# Altium schematic sheet NVME.SchDoc
size C; SheetNumber: 5; SheetTotal: 11
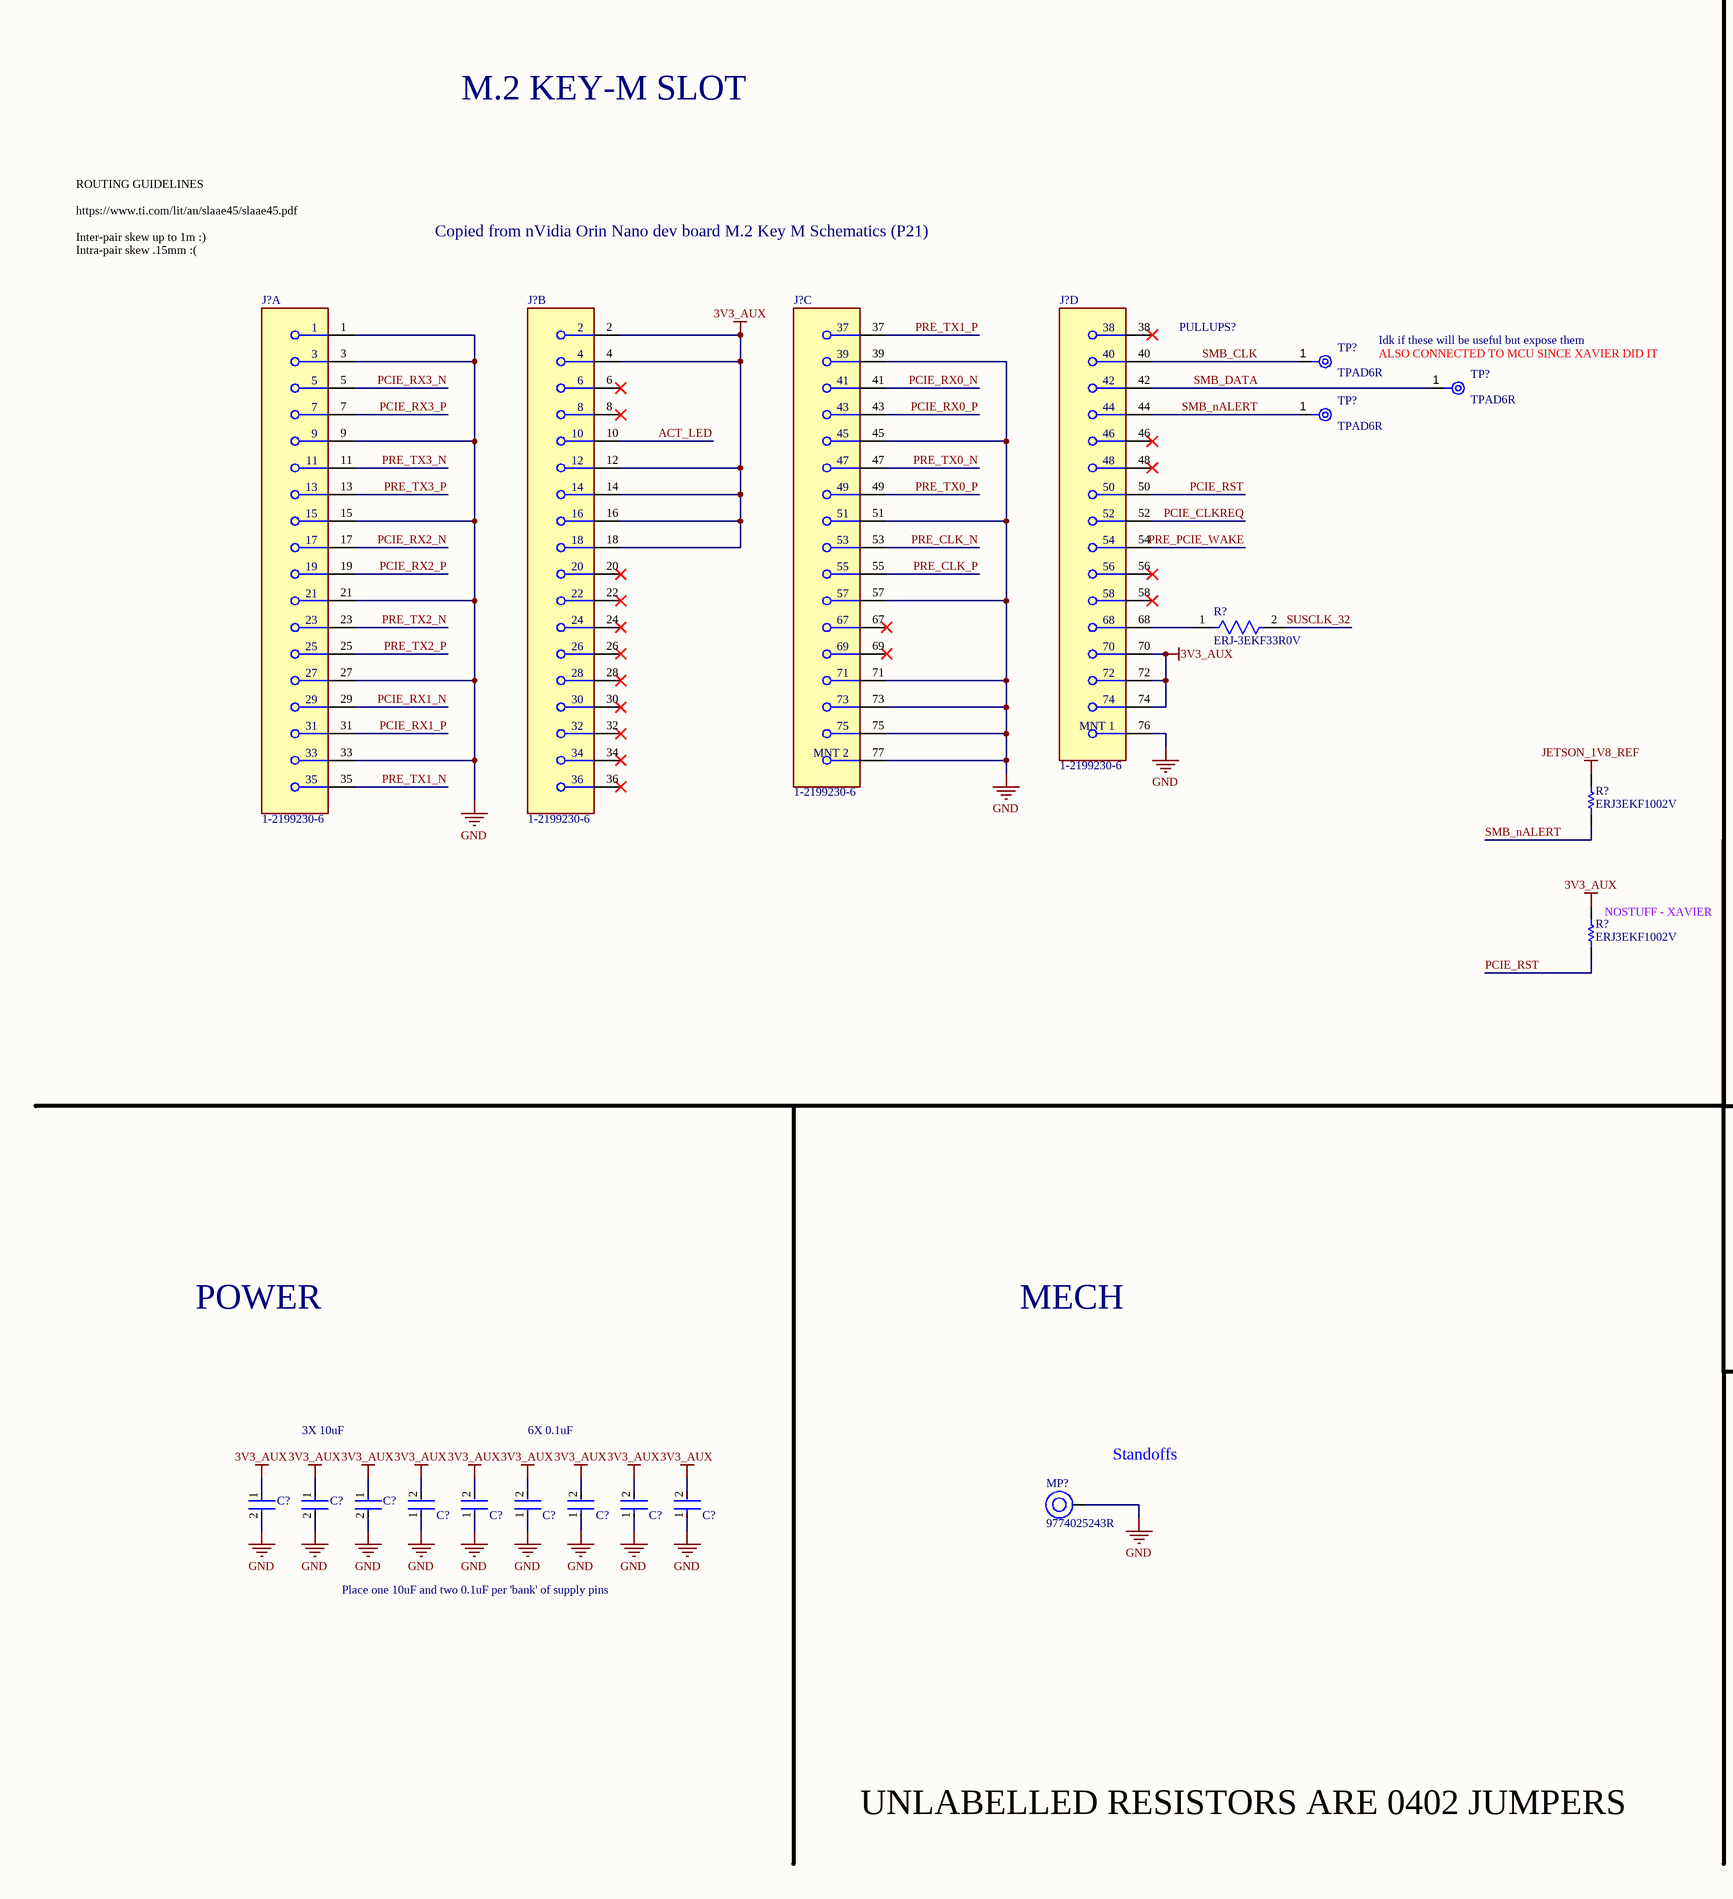
[diagram p0: NVME.SchDoc, left]
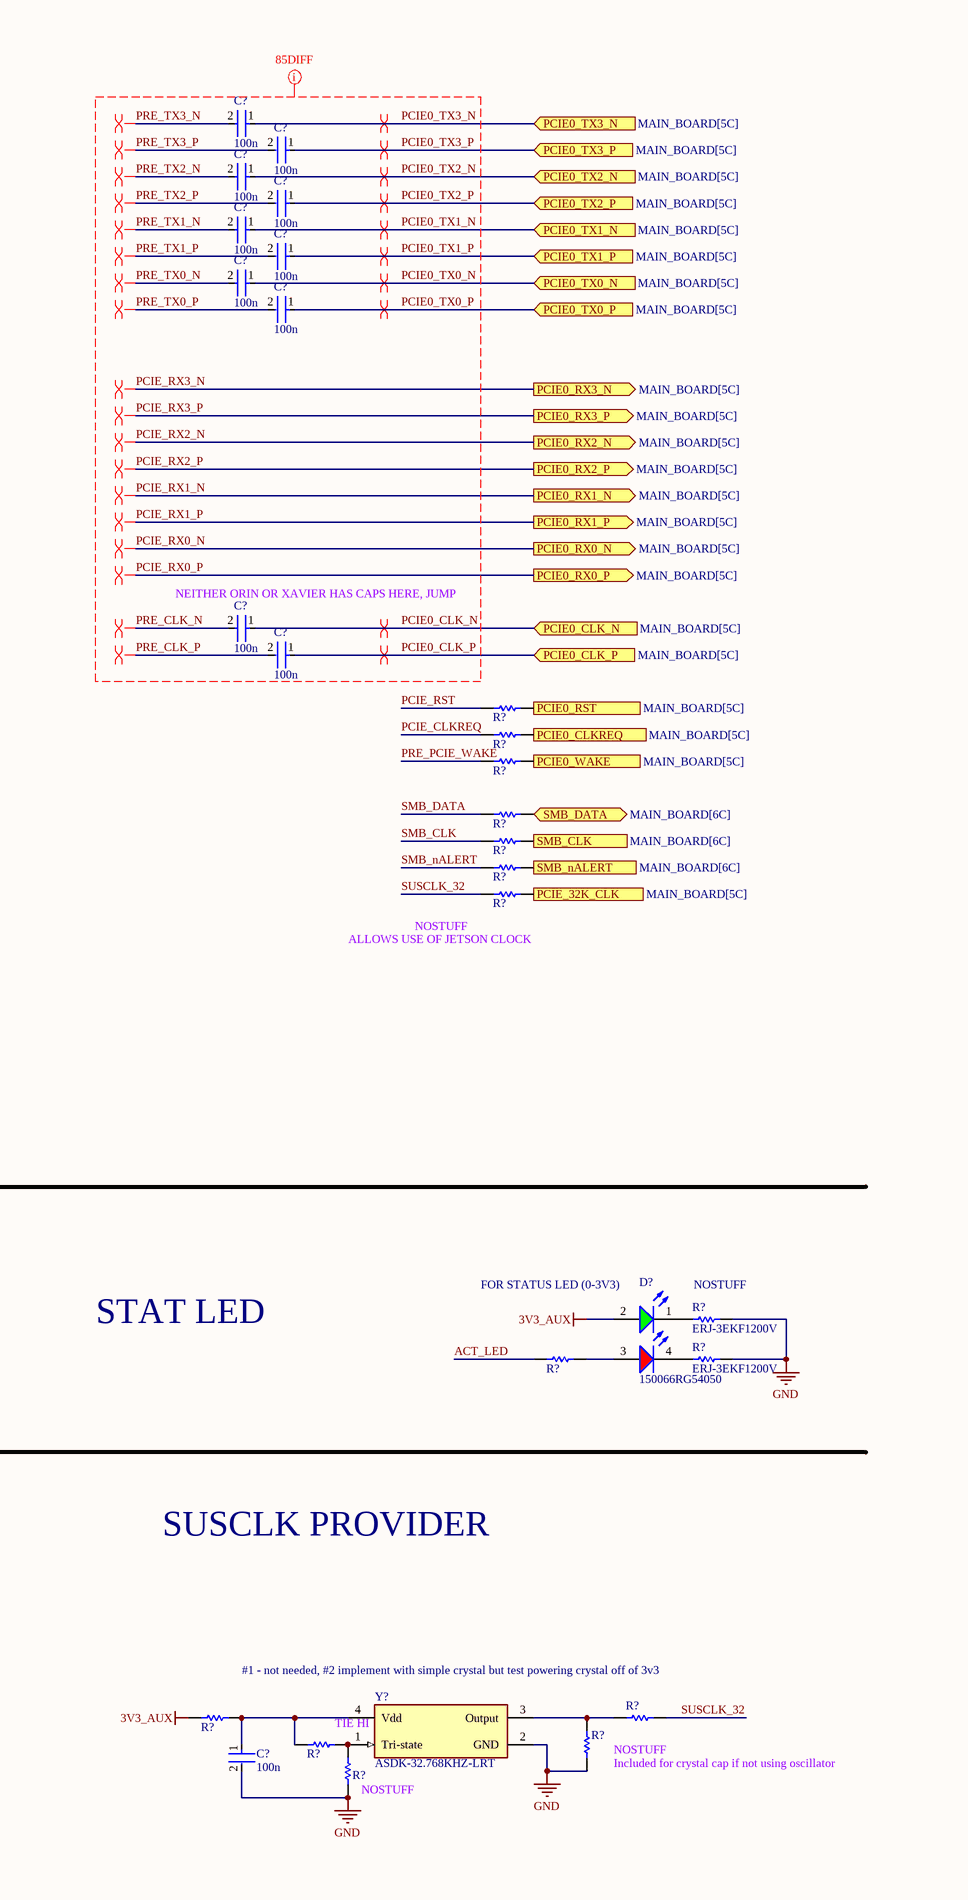
[diagram p1: NVME.SchDoc, right]

## Parts
(Parts that share a designator on the sheet are numbered #1, #2 ... from top to bottom, then left to right.)
C?#1  100n  [FP-0402-L_1_0_0_05-W_0_5-IPC_A]
C?#2  100n  [FP-0402-L_1_0_0_05-W_0_5-IPC_A]
C?#3  100n  [FP-0402-L_1_0_0_05-W_0_5-IPC_A]
C?#4  100n  [FP-0402-L_1_0_0_05-W_0_5-IPC_A]
C?#5  100n  [FP-0402-L_1_0_0_05-W_0_5-IPC_A]
C?#6  100n  [FP-0402-L_1_0_0_05-W_0_5-IPC_A]
C?#7  100n  [FP-0402-L_1_0_0_05-W_0_5-IPC_A]
C?#8  100n  [FP-0402-L_1_0_0_05-W_0_5-IPC_A]
C?#9  100n  [FP-0402-L_1_0_0_05-W_0_5-IPC_A]
C?#10  100n  [FP-0402-L_1_0_0_05-W_0_5-IPC_A]
C?#11  GRM188R60J106ME47D  [FP-GRM188-0_1-e0_2_0_55-IPC_A]  (value not drawn)
C?#12  GRM188R60J106ME47D  [FP-GRM188-0_1-e0_2_0_55-IPC_A]  (value not drawn)
C?#13  GRM188R60J106ME47D  [FP-GRM188-0_1-e0_2_0_55-IPC_A]  (value not drawn)
C?#14  C1005X7R1H104K050BB  [FP-C1005-050-0_05-IPC_C]  (value not drawn)
C?#15  C1005X7R1H104K050BB  [FP-C1005-050-0_05-IPC_C]  (value not drawn)
C?#16  C1005X7R1H104K050BB  [FP-C1005-050-0_05-IPC_C]  (value not drawn)
C?#17  C1005X7R1H104K050BB  [FP-C1005-050-0_05-IPC_C]  (value not drawn)
C?#18  C1005X7R1H104K050BB  [FP-C1005-050-0_05-IPC_C]  (value not drawn)
C?#19  C1005X7R1H104K050BB  [FP-C1005-050-0_05-IPC_C]  (value not drawn)
C?#20  100n  [FP-0402-L_1_0_0_05-W_0_5-IPC_A]
D?  150066RG54050  [WL-SBCD_0606]
J?#1  1-2199230-6  [FP-1-2199230-6-MFG]  (part A of 4)
J?#2  1-2199230-6  [FP-1-2199230-6-MFG]  (part B of 4)
J?#3  1-2199230-6  [FP-1-2199230-6-MFG]  (part C of 4)
J?#4  1-2199230-6  [FP-1-2199230-6-MFG]  (part D of 4)
MP?  9774025243R  [9774025243]
R?#1  0402 JUMPER  [RESC1005X40X25ML05T05]  (value not drawn)
R?#2  ERJ-3EKF33R0V  [FP-ERJ3EK-MFG]
R?#3  0402 JUMPER  [RESC1005X40X25ML05T05]  (value not drawn)
R?#4  0402 JUMPER  [RESC1005X40X25ML05T05]  (value not drawn)
R?#5  0402 JUMPER  [RESC1005X40X25ML05T05]  (value not drawn)
R?#6  0402 JUMPER  [RESC1005X40X25ML05T05]  (value not drawn)
R?#7  0402 JUMPER  [RESC1005X40X25ML05T05]  (value not drawn)
R?#8  0402 JUMPER  [RESC1005X40X25ML05T05]  (value not drawn)
R?#9  ERJ3EKF1002V  [RESC1609X55X30LL15T15]
R?#10  ERJ3EKF1002V  [RESC1609X55X30LL15T15]
R?#11  ERJ-3EKF1200V  [RESC1609X55X30ML15T15]
R?#12  0402 JUMPER  [RESC1005X40X25ML05T05]  (value not drawn)
R?#13  ERJ-3EKF1200V  [RESC1609X55X30ML15T15]
R?#14  0402 JUMPER  [RESC1005X40X25ML05T05]  (value not drawn)
R?#15  0402 JUMPER  [RESC1005X40X25ML05T05]  (value not drawn)
R?#16  0402 JUMPER  [RESC1005X40X25ML05T05]  (value not drawn)
R?#17  0402 JUMPER  [RESC1005X40X25ML05T05]  (value not drawn)
R?#18  0402 JUMPER  [RESC1005X40X25ML05T05]  (value not drawn)
TP?#1  TPAD6R  [New footprint 1]
TP?#2  TPAD6R  [New footprint 1]
TP?#3  TPAD6R  [New footprint 1]
Y?  ASDK-32.768KHZ-LRT  [FP-ASDK-MFG]

## Ports
PCIE0_CLK_N (in, see MAIN_BOARD[5C]), PCIE0_CLK_P (in, see MAIN_BOARD[5C]), PCIE0_CLKREQ (out, see MAIN_BOARD[5C]), PCIE0_RST (in, see MAIN_BOARD[5C]), PCIE0_RX0_N (out, see MAIN_BOARD[5C]), PCIE0_RX0_P (out, see MAIN_BOARD[5C]), PCIE0_RX1_N (out, see MAIN_BOARD[5C]), PCIE0_RX1_P (out, see MAIN_BOARD[5C]), PCIE0_RX2_N (out, see MAIN_BOARD[5C]), PCIE0_RX2_P (out, see MAIN_BOARD[5C]), PCIE0_RX3_N (out, see MAIN_BOARD[5C]), PCIE0_RX3_P (out, see MAIN_BOARD[5C]), PCIE0_TX0_N (in, see MAIN_BOARD[5C]), PCIE0_TX0_P (in, see MAIN_BOARD[5C]), PCIE0_TX1_N (in, see MAIN_BOARD[5C]), PCIE0_TX1_P (in, see MAIN_BOARD[5C]), PCIE0_TX2_N (in, see MAIN_BOARD[5C]), PCIE0_TX2_P (in, see MAIN_BOARD[5C]), PCIE0_TX3_N (in, see MAIN_BOARD[5C]), PCIE0_TX3_P (in, see MAIN_BOARD[5C]), PCIE0_WAKE (out, see MAIN_BOARD[5C]), PCIE_32K_CLK (in, see MAIN_BOARD[5C]), SMB_CLK (in, see MAIN_BOARD[6C]), SMB_DATA (bidir, see MAIN_BOARD[6C]), SMB_nALERT (out, see MAIN_BOARD[6C])

## Nets
3V3_AUX: C?#11.1 C?#12.1 C?#13.1 C?#14.2 C?#15.2 C?#16.2 C?#17.2 C?#18.2 C?#19.2 D?.2(A) J?#2.2 J?#2.4 J?#2.12 J?#2.14 J?#2.16 J?#2.18 J?#4.70 J?#4.72 J?#4.74 R?#10.2 R?#14.1
GND: C?#11.2 C?#12.2 C?#13.2 C?#14.1 C?#15.1 C?#16.1 C?#17.1 C?#18.1 C?#19.1 C?#20.2 J?#1.1 J?#1.3 J?#1.9 J?#1.15 J?#1.21 J?#1.27 J?#1.33 J?#3.39 J?#3.45 J?#3.51 J?#3.57 J?#3.71 J?#3.73 J?#3.75 J?#3.77(MNT_2) J?#4.76(MNT_1) MP?.1 R?#11.1 R?#13.1 R?#17.1 R?#18.1 Y?.2(GND)
JETSON_1V8_REF: R?#9.2
ACT_LED: J?#2.10 R?#12.1
PCIE0_CLK_N: C?#9.1 ; port PCIE0_CLK_N
PCIE0_CLK_P: C?#10.1 ; port PCIE0_CLK_P
PCIE0_CLKREQ: R?#3.2 ; port PCIE0_CLKREQ
PCIE0_RST: R?#1.2 ; port PCIE0_RST
PCIE0_TX0_N: C?#7.1 ; port PCIE0_TX0_N
PCIE0_TX0_P: C?#8.1 ; port PCIE0_TX0_P
PCIE0_TX1_N: C?#5.1 ; port PCIE0_TX1_N
PCIE0_TX1_P: C?#6.1 ; port PCIE0_TX1_P
PCIE0_TX2_N: C?#3.1 ; port PCIE0_TX2_N
PCIE0_TX2_P: C?#4.1 ; port PCIE0_TX2_P
PCIE0_TX3_N: C?#1.1 ; port PCIE0_TX3_N
PCIE0_TX3_P: C?#2.1 ; port PCIE0_TX3_P
PCIE0_WAKE: R?#4.2 ; port PCIE0_WAKE
PCIE_32K_CLK: R?#8.2 ; port PCIE_32K_CLK
PCIE_CLKREQ: J?#4.52 R?#3.1
PCIE_RST: J?#4.50 R?#1.1 R?#10.1
PCIE_RX0_N: J?#3.41 ; port PCIE0_RX0_N
PCIE_RX0_P: J?#3.43 ; port PCIE0_RX0_P
PCIE_RX1_N: J?#1.29 ; port PCIE0_RX1_N
PCIE_RX1_P: J?#1.31 ; port PCIE0_RX1_P
PCIE_RX2_N: J?#1.17 ; port PCIE0_RX2_N
PCIE_RX2_P: J?#1.19 ; port PCIE0_RX2_P
PCIE_RX3_N: J?#1.5 ; port PCIE0_RX3_N
PCIE_RX3_P: J?#1.7 ; port PCIE0_RX3_P
PRE_CLK_N: C?#9.2 J?#3.53
PRE_CLK_P: C?#10.2 J?#3.55
PRE_PCIE_WAKE: J?#4.54 R?#4.1
PRE_TX0_N: C?#7.2 J?#3.47
PRE_TX0_P: C?#8.2 J?#3.49
PRE_TX1_N: C?#5.2 J?#1.35
PRE_TX1_P: C?#6.2 J?#3.37
PRE_TX2_N: C?#3.2 J?#1.23
PRE_TX2_P: C?#4.2 J?#1.25
PRE_TX3_N: C?#1.2 J?#1.11
PRE_TX3_P: C?#2.2 J?#1.13
SMB_CLK: J?#4.40 R?#6.1 TP?#1.1(TP)
SMB_CLK: R?#6.2 ; port SMB_CLK  [a separate net that carries the same name]
SMB_DATA: J?#4.42 R?#5.1 TP?#2.1(TP)
SMB_DATA: R?#5.2 ; port SMB_DATA  [a separate net that carries the same name]
SMB_nALERT: J?#4.44 R?#7.1 R?#9.1 TP?#3.1(TP)
SMB_nALERT: R?#7.2 ; port SMB_nALERT  [a separate net that carries the same name]
SUSCLK_32: R?#2.2 R?#8.1 R?#16.1
NetC?#20_1: C?#20.1 R?#14.2 R?#15.1 Y?.4(Vdd)
NetD?_1: D?.1(K) R?#11.2
NetD?_3: D?.3(A) R?#12.2
NetD?_4: D?.4(K) R?#13.2
NetJ?#4_68: J?#4.68 R?#2.1
NetR?#15_2: R?#15.2 R?#18.2 Y?.1(Tri-state)
NetR?#16_2: R?#16.2 R?#17.2 Y?.3(Output)

Not connected (* = marked no-connect by the designer): J?#2 6* 8* 20* 22* 24* 26* 28* 30* 32* 34* 36*; J?#3 67* 69*; J?#4 38* 46* 48* 56* 58*

## Layout directives
differential pair; differential pair class 85DIFF: PCIE0_CLK_N, PCIE0_CLK_P, PCIE0_TX0_N, PCIE0_TX0_P, PCIE0_TX1_N, PCIE0_TX1_P, PCIE0_TX2_N, PCIE0_TX2_P, PCIE0_TX3_N, PCIE0_TX3_P, PCIE_RX0_N, PCIE_RX0_P, PCIE_RX1_N, PCIE_RX1_P, PCIE_RX2_N, PCIE_RX2_P, PCIE_RX3_N, PCIE_RX3_P, PRE_CLK_N, PRE_CLK_P, PRE_TX0_N, PRE_TX0_P, PRE_TX1_N, PRE_TX1_P, PRE_TX2_N, PRE_TX2_P, PRE_TX3_N, PRE_TX3_P
net class 85DIFF: PCIE0_CLK_N, PCIE0_CLK_P, PCIE0_TX0_N, PCIE0_TX0_P, PCIE0_TX1_N, PCIE0_TX1_P, PCIE0_TX2_N, PCIE0_TX2_P, PCIE0_TX3_N, PCIE0_TX3_P, PCIE_RX0_N, PCIE_RX0_P, PCIE_RX1_N, PCIE_RX1_P, PCIE_RX2_N, PCIE_RX2_P, PCIE_RX3_N, PCIE_RX3_P, PRE_CLK_N, PRE_CLK_P, PRE_TX0_N, PRE_TX0_P, PRE_TX1_N, PRE_TX1_P, PRE_TX2_N, PRE_TX2_P, PRE_TX3_N, PRE_TX3_P

## Notes on the sheet
- M.2 KEY-M SLOT
- ROUTING GUIDELINES
  https://www.ti.com/lit/an/slaae45/slaae45.pdf
  Inter-pair skew up to 1m :)
  Intra-pair skew .15mm :(
- Copied from nVidia Orin Nano dev board M.2 Key M Schematics (P21)
- PULLUPS?
- (near TP?#2) Idk if these will be useful but expose them
- (near TP?#2) ALSO CONNECTED TO MCU SINCE XAVIER DID IT
- (near C?#9) NEITHER ORIN OR XAVIER HAS CAPS HERE, JUMP
- (near R?#8) ALLOWS USE OF JETSON CLOCK
- (near R?#8) NOSTUFF
- (near R?#10) NOSTUFF - XAVIER
- STAT LED
- (near D?) FOR STATUS LED (0-3V3)
- (near R?#11) NOSTUFF
- POWER
- MECH
- 3X 10uF
- 6X 0.1uF
- Standoffs
- SUSCLK PROVIDER
- Place one 10uF and two 0.1uF per 'bank' of supply pins
- #1 - not needed, #2 implement with simple crystal but test powering crystal off of 3v3
- (near Y?) TIE HI
- (near R?#18) NOSTUFF
- (near R?#17) NOSTUFF
- (near R?#17) Included for crystal cap if not using oscillator
- UNLABELLED RESISTORS ARE 0402 JUMPERS

## Library data of the parts
C?#1-C?#10 C?#20 = CMP-001-00058-1: LARGE PADS, 0402 CAP, CHANGE COMMENT TO MATCH REAL P/N; Capacitor Type: Ceramic; Min Operating Temperature: -55°C; Mounting Technology: Surface Mount; Pins: 2; Case/Package: 0402; RoHS Compliant: Yes; Max Operating Temperature: 85°C
C?#11-C?#13 = CMP-2006-02792-2: Chip Multilayer Ceramic Capacitors for General Purpose, 0603, 10uF, X5R, 15%, 20%, 6.3V; Packaging: Tape and Reel; Voltage Rating (DC): 6.3V; Width: 0.031inch; Termination: SMD/SMT; Dielectric: X5R; Package Quantity: 4000; Voltage Rating: 6.3V; Capacitance: 10uF; Case/Package: 0603; Min Operating Temperature: -55°C; Voltage: 6.3V; Length: 1.6mm; Thickness: 0.035inch; Lead Free: Lead Free; Depth: 0.8mm; Case Code (Imperial): 0603; Max Operating Temperature: 85°C; Material: Ceramic; Height: 0.8mm; Tolerance: 20%; Mount: Surface Mount; REACH SVHC: No SVHC; Radiation Hardening: No; Case Code (Metric): 1608
C?#14-C?#19 = CMP-2000-05393-2: Multilayer Ceramic Capacitors 100nF ±10% 50V X7R SMD 0402; Voltage: 50V; Dielectric Material: Ceramic; Min Operating Temperature: -55°C; Depth: 0.5mm; Radiation Hardening: No; RoHS Compliant: Yes; Voltage Rating (DC): 50V; Lead Free: Lead Free; Resistor Type: Ceramic; Height: 0.5mm; Dielectric: X7R; Thickness: 0.022inch; Case/Package: 0402; Case Code (Metric): 1005; Termination: SMD/SMT; Capacitance: 100nF; Packaging: Tape and Reel; Max Operating Temperature: 125°C; Mount: Surface Mount; Package Quantity: 1; Width: 0.02inch; Weight: 2.3E-05oz; Voltage Rating: 50V; Tolerance: 10%; Construction: Flat; Case Code (Imperial): 0402; Length: 1mm; REACH SVHC: No SVHC; Series: C
D? = CMP-004-00040-2: Led, Red/Grn, 180Mcd/230Mcd, 624Nm/525Nm Rohs Compliant: Yes; Source: rgled.SchLib; Component Type: Standard; Pins: 4; Design Item ID: CMP-004-00034-2
J?#1-J?#4 = CMP-03365-000001-1: CONN EDGE DUAL FMALE 67POS 0.020; Manufacturer: TE; Number Of Contacts: 67; Current Rating: 0.5A; Pitch: 0.5mm; Conn Gender: Female; Is Female: yes; Voltage Rating: 50V; Conn Orientation: Right Angle; Automotive: No; Temperature Range High: +80°C; Package: 1-2199230-6; Category: Conn; Temperature: -40°C to +80°C; Number Of Rows: 2; ComponentLink2URL: http://www.te.com/commerce/DocumentDelivery/DDEController?Action=showdoc&DocId=Specification+Or+Standard%7F114-115006%7FB%7Fpdf%7FEnglish%7FENG_SS_114-115006_B_114-115006_REV_B.pdf%7F1-2199230-6; Manufacturer Part Number: 1-2199230-6; Height: 4.2mm; RoHS: TRUE; Footprint Url: http://www.te.com/commerce/DocumentDelivery/DDEController?Action=showdoc&DocId=Customer+Drawing%7F2199230%7FB2%7Fpdf%7FEnglish%7FENG_CD_2199230_B2.pdf%7F1-2199230-6; Digikey Description: CONN EDGE DUAL FMALE 67POS 0.020; Device Class L2: Card Edge Connectors; Contact Material: Gold,Tin; Device Class L1: Connectors; Device Class L3: unset; ComponentLink2Description: Datasheet; Temperature Range Low: -40°C; Octopart: https://octopart.com/1-2199230-6-te+connectivity-34969376; Lead Free: Yes
MP? = CMP-03913-59774857-1: 9774025243R Spacer Material: Steel, Tin-Plated Mounting: SMT Series: WA-SMST Thread D: M2; Outside Diameter: 4.3434mm; Threaded/Unthreaded: Threaded; Plating: Tin; REACH SVHC: Unknown; NexarPartId: 59774857; RoHS: Compliant; Material: Steel; Packaging: Tape and Reel; Max Operating Temperature: 150°C; Min Operating Temperature: -55°C; Length: 2.5mm; Height: 2.5mm
R?#1 R?#3-R?#8 R?#12 R?#14-R?#18 = CMP-009-00118-2: READ THE NAME; Pins: 2; Component Type: Standard; Design Item ID: CMP-009-00206-2; Source: 0402jump.SchLib
R?#2 = CMP-2000-00443-2: RES SMD 33 OHM 1% 1/10W 0603; Voltage Rating (DC): 75V; Power Rating: 100mW; Resistance: 33R; Temperature Coefficient: 100ppm/°C; Min Operating Temperature: -55°C; Packaging: Tape and Reel; Mount: Surface Mount; Lead Free: Lead Free; Voltage Rating: 75V; Features: Automotive AEC-Q200; Height: 0.022inch; Width: 0.031inch; Number of Pins: 2; Package Quantity: 1; Case Code (Metric): 1608; Max Power Dissipation: 100mW; Case Code (Imperial): 0603; Termination: SMD/SMT; Resistance Tolerance: 1%; Max Operating Temperature: 155°C; Tolerance: 1%; Length: 1.6mm; Case/Package: 0603; Military Standard: Not; RoHS Compliant: Yes; Series: ERJ; Size Code: 0603; Construction: Rectangular; Number of Terminations: 2; Radiation Hardening: No; Resistor Type: Thick Film; Contact Plating: Tin; Depth: 0.8mm; REACH SVHC: No SVHC
R?#9 R?#10 = CMP-1012-00623-3: Chip Resistor, 10 KOhm, +/- 1%, 0.1 W, -55 to 155 degC, 0603 (1608 Metric), RoHS, Tape and Reel; Manufacturer: Panasonic; Voltage Rating: 75V; Case\/Package: 0603; Power Rating: 100mW; Resistance: 10KOhm; Temperature Coefficient: 100ppm\/degreesC; Number of Pins: 2; Package Reference: 603; Depth: 0.8mm; Mount: SurfaceMount; Package Description: 2-Pin Surface Mount Device, Body 1.6 x 0.85 mm; Datasheet Version: 02/2017; Length: 1.6mm; Lead Free: LeadFree; Height: 0.45mm; Number of Terminations: 2; Max Power Dissipation: 100mW; Min Operating Temperature: -55degC; Datasheet URL: https://industrial.panasonic.com/cdbs/www-data/pdf/RDA0000/AOA0000C304.pdf; Termination: SMD/SMT; Case Code (Metric): 1608; Case Code (Imperial): 0603; Tolerance: 1%; Max Operating Temperature: 155degC; RoHSCompliant: true; Voltage Rating (DC): 75V; Radiation Hardening: No; Packaging: TapeandReel; Composition: ThickFilm; Mounting Technology: SurfaceMount; Manufacturer URL: http://www.panasonic.com/; Width: 0.031inch; REACH SVHC: NoSVHC; Contact Plating: Tin; Military Standard: Not; Package Quantity: 1
R?#11 R?#13 = CMP-2000-00213-2: Chip Resistor, 120 Ohm, +/- 1%, 0.1 W, -55 to 155 degC, 0603 (1608 Metric), RoHS, Tape and Reel; Manufacturer: Panasonic; Power Rating: 100mW; Voltage Rating (DC): 75V; Resistance: 120Ohm; Temperature Coefficient: 100ppm/degreesC; Number of Terminations: 2; Military Standard: Not; Tolerance: 1%; Min Operating Temperature: -55degC; Packaging: TapeandReel; Lead Free: LeadFree; Max Operating Temperature: 155degC; Manufacturer URL: http://www.panasonic.com/; Case Code (Imperial): 0603; REACH SVHC: NoSVHC; Width: 0.031inch; Datasheet URL: https://industrial.panasonic.com/cdbs/www-data/pdf/RDA0000/AOA0000C283.pdf; RoHSCompliant: true; Max Power Dissipation: 100mW; Termination: SMD/SMT; Package Reference: 0603; Height: 0.022inch; Depth: 0.8mm; Package Description: 2-Pin Surface Mount Device, Body 1.6 x 0.85 mm; Contact Plating: Tin; Length: 1.6mm; Package URL: http://www.st.com/st-web-ui/static/active/en/resource/technical/document/datasheet/CD00001320.pdf; Radiation Hardening: No; Package Quantity: 1; Number of Pins: 2; Datasheet Version: 42095.0; Voltage Rating: 75V; Composition: ThickFilm; Case/Package: 0603; Mount: SurfaceMount; Case Code (Metric): 1608
TP?#1-TP?#3 = CMP-00025-2: Test Point .6mm
Y? = CMP-27762-001115-1: XTAL OSC XO 32.7680KHZ CMOS SMD; Load Capacitance: 15pF; Max Supply Current: 3.5mA; Min Supply Voltage: 2.97V; Operating Supply Voltage: 3.3V; Frequency Stability: 25ppm; Lead Free: Lead Free; Case/Package: CSMD; Number of Pins: 4; Max Operating Temperature: 85°C; Packaging: Tape and Reel; Width: 0.079inch; Min Operating Temperature: -40°C; Radiation Hardening: No; Length: 2.5mm; Depth: 2mm; Termination: SMD/SMT; Height: 0.037inch; Series: ASDK; Frequency: 32.768kHz; Mount: Surface Mount